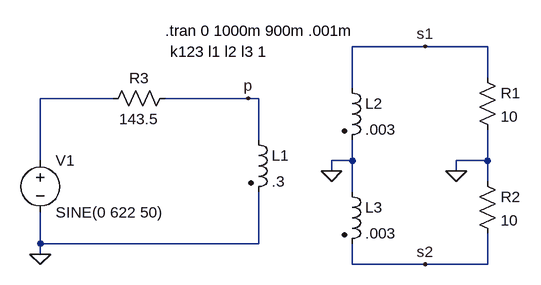
[diagram p0: schematic trafopuntomedio.asc]
trafopuntomedio.asc, the LTspice schematic file:
Version 4
SHEET 1 896 680
WIRE 416 -240 304 -240
WIRE 512 -240 416 -240
WIRE 512 -192 512 -240
WIRE 304 -176 304 -240
WIRE -64 -160 -176 -160
WIRE 144 -160 16 -160
WIRE 160 -160 144 -160
WIRE 160 -96 160 -160
WIRE -176 -64 -176 -160
WIRE 304 -64 304 -96
WIRE 304 -64 272 -64
WIRE 512 -64 512 -112
WIRE 512 -64 464 -64
WIRE 272 -48 272 -64
WIRE 464 -48 464 -64
WIRE 512 -32 512 -64
WIRE 304 -16 304 -64
WIRE -176 64 -176 16
WIRE 160 64 160 -16
WIRE 160 64 -176 64
WIRE -176 80 -176 64
WIRE 304 96 304 64
WIRE 416 96 304 96
WIRE 512 96 512 48
WIRE 512 96 416 96
FLAG -176 80 0
FLAG 272 -48 0
FLAG 464 -48 0
FLAG 144 -160 p
FLAG 416 -240 s1
FLAG 416 96 s2
DATAFLAG 112 -160 ""
SYMBOL voltage -176 -80 R0
WINDOW 123 24 44 Left 2
WINDOW 39 0 0 Left 0
SYMATTR InstName V1
SYMATTR Value SINE(0 622 50)
SYMBOL ind2 144 -112 R0
SYMATTR InstName L1
SYMATTR Value .3
SYMBOL ind2 288 -192 R0
SYMATTR InstName L2
SYMATTR Value .003
SYMBOL res 496 -208 R0
SYMATTR InstName R1
SYMATTR Value 10
SYMBOL res 32 -176 R90
WINDOW 0 0 56 VBottom 2
WINDOW 3 32 56 VTop 2
SYMATTR InstName R3
SYMATTR Value 143.5
SYMBOL ind2 288 -32 R0
SYMATTR InstName L3
SYMATTR Value .003
SYMBOL res 496 -48 R0
SYMATTR InstName R2
SYMATTR Value 10
TEXT 16 -264 Left 2 !.tran 0 1000m 900m .001m
TEXT 24 -232 Left 2 !k123 l1 l2 l3 1

The netlist it stands for:
* trafopuntomedio.asc
V1 N001 0 SINE(0 622 50)
L1 p 0 .3
L2 s1 0 .003
R1 s1 0 10
R3 p N001 143.5
L3 0 s2 .003
R2 0 s2 10
.tran 0 1000m 900m .001m
k123 l1 l2 l3 1
.backanno
.end